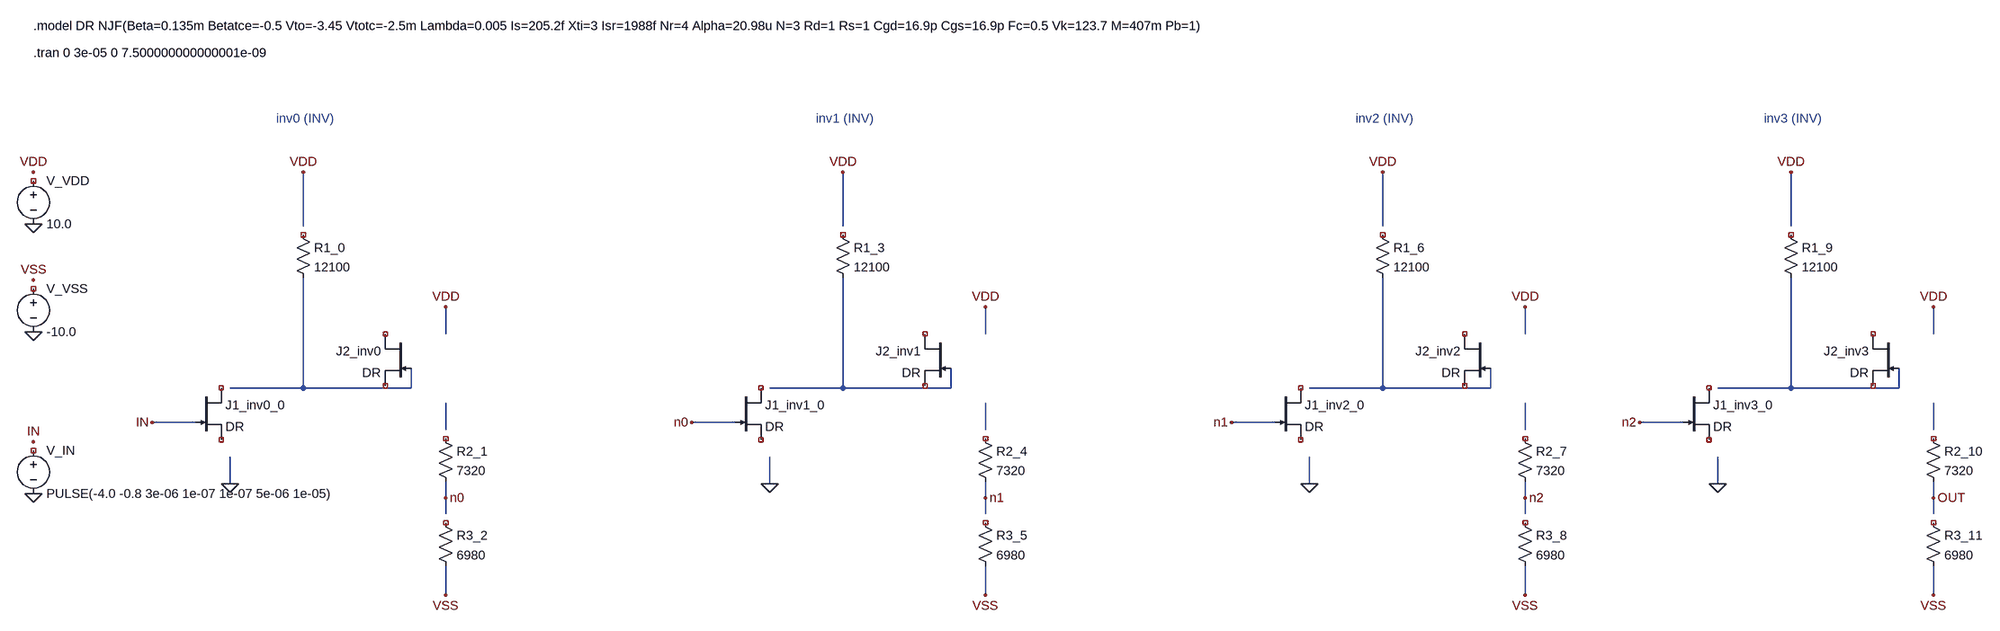
[diagram p0: schematic inv_chain_4.asc]
inv_chain_4.asc, the LTspice schematic file:
Version 4
SHEET 1 10000 10000
WIRE 0 0 0 100
FLAG 0 0 VDD
SYMBOL res -16 100 R0
SYMATTR InstName R1_0
SYMATTR Value 12100
WIRE 0 196 0 400
WIRE 0 400 -136 400
SYMBOL njf -200 400 R0
SYMATTR InstName J1_inv0_0
SYMATTR Value DR
WIRE -136 528 -136 578
FLAG -136 578 0
WIRE -200 464 -280 464
FLAG -280 464 IN
WIRE 0 400 200 400
WIRE 200 400 200 364
SYMBOL njf 200 300 M0
SYMATTR InstName J2_inv0
SYMATTR Value DR
WIRE 264 300 264 250
FLAG 264 250 VDD
WIRE 264 428 264 478
SYMBOL res 248 478 R0
SYMATTR InstName R2_1
SYMATTR Value 7320
WIRE 264 574 264 604
FLAG 264 604 n0
WIRE 264 604 264 634
SYMBOL res 248 634 R0
SYMATTR InstName R3_2
SYMATTR Value 6980
WIRE 264 730 264 784
FLAG 264 784 VSS
TEXT -50 -100 Left 2 ;inv0 (INV)
WIRE 1000 0 1000 100
FLAG 1000 0 VDD
SYMBOL res 984 100 R0
SYMATTR InstName R1_3
SYMATTR Value 12100
WIRE 1000 196 1000 400
WIRE 1000 400 864 400
SYMBOL njf 800 400 R0
SYMATTR InstName J1_inv1_0
SYMATTR Value DR
WIRE 864 528 864 578
FLAG 864 578 0
WIRE 800 464 720 464
FLAG 720 464 n0
WIRE 1000 400 1200 400
WIRE 1200 400 1200 364
SYMBOL njf 1200 300 M0
SYMATTR InstName J2_inv1
SYMATTR Value DR
WIRE 1264 300 1264 250
FLAG 1264 250 VDD
WIRE 1264 428 1264 478
SYMBOL res 1248 478 R0
SYMATTR InstName R2_4
SYMATTR Value 7320
WIRE 1264 574 1264 604
FLAG 1264 604 n1
WIRE 1264 604 1264 634
SYMBOL res 1248 634 R0
SYMATTR InstName R3_5
SYMATTR Value 6980
WIRE 1264 730 1264 784
FLAG 1264 784 VSS
TEXT 950 -100 Left 2 ;inv1 (INV)
WIRE 2000 0 2000 100
FLAG 2000 0 VDD
SYMBOL res 1984 100 R0
SYMATTR InstName R1_6
SYMATTR Value 12100
WIRE 2000 196 2000 400
WIRE 2000 400 1864 400
SYMBOL njf 1800 400 R0
SYMATTR InstName J1_inv2_0
SYMATTR Value DR
WIRE 1864 528 1864 578
FLAG 1864 578 0
WIRE 1800 464 1720 464
FLAG 1720 464 n1
WIRE 2000 400 2200 400
WIRE 2200 400 2200 364
SYMBOL njf 2200 300 M0
SYMATTR InstName J2_inv2
SYMATTR Value DR
WIRE 2264 300 2264 250
FLAG 2264 250 VDD
WIRE 2264 428 2264 478
SYMBOL res 2248 478 R0
SYMATTR InstName R2_7
SYMATTR Value 7320
WIRE 2264 574 2264 604
FLAG 2264 604 n2
WIRE 2264 604 2264 634
SYMBOL res 2248 634 R0
SYMATTR InstName R3_8
SYMATTR Value 6980
WIRE 2264 730 2264 784
FLAG 2264 784 VSS
TEXT 1950 -100 Left 2 ;inv2 (INV)
WIRE 3000 0 3000 100
FLAG 3000 0 VDD
SYMBOL res 2984 100 R0
SYMATTR InstName R1_9
SYMATTR Value 12100
WIRE 3000 196 3000 400
WIRE 3000 400 2864 400
SYMBOL njf 2800 400 R0
SYMATTR InstName J1_inv3_0
SYMATTR Value DR
WIRE 2864 528 2864 578
FLAG 2864 578 0
WIRE 2800 464 2720 464
FLAG 2720 464 n2
WIRE 3000 400 3200 400
WIRE 3200 400 3200 364
SYMBOL njf 3200 300 M0
SYMATTR InstName J2_inv3
SYMATTR Value DR
WIRE 3264 300 3264 250
FLAG 3264 250 VDD
WIRE 3264 428 3264 478
SYMBOL res 3248 478 R0
SYMATTR InstName R2_10
SYMATTR Value 7320
WIRE 3264 574 3264 604
FLAG 3264 604 OUT
WIRE 3264 604 3264 634
SYMBOL res 3248 634 R0
SYMATTR InstName R3_11
SYMATTR Value 6980
WIRE 3264 730 3264 784
FLAG 3264 784 VSS
TEXT 2950 -100 Left 2 ;inv3 (INV)
SYMBOL voltage -500 0 R0
SYMATTR InstName V_VDD
SYMATTR Value 10.0
FLAG -500 0 VDD
FLAG -500 96 0
SYMBOL voltage -500 200 R0
SYMATTR InstName V_VSS
SYMATTR Value -10.0
FLAG -500 200 VSS
FLAG -500 296 0
SYMBOL voltage -500 500 R0
SYMATTR InstName V_IN
SYMATTR Value PULSE(-4.0 -0.8 3e-06 1e-07 1e-07 5e-06 1e-05)
FLAG -500 500 IN
FLAG -500 596 0
TEXT -500 -300 Left 2 !.tran 0 3e-05 0 7.500000000000001e-09
TEXT -500 -350 Left 2 !.model DR NJF(Beta=0.135m Betatce=-0.5 Vto=-3.45 Vtotc=-2.5m Lambda=0.005 Is=205.2f Xti=3 Isr=1988f Nr=4 Alpha=20.98u N=3 Rd=1 Rs=1 Cgd=16.9p Cgs=16.9p Fc=0.5 Vk=123.7 M=407m Pb=1)

The netlist it stands for:
* inv_chain_4.asc
R1_0 NC_01 N001 12100
J1_inv0_0 NC_02 IN NC_03 DR
J2_inv0 NC_04 N001 NC_05 DR
R2_1 NC_06 n0 7320
R3_2 NC_07 VSS 6980
R1_3 NC_08 N003 12100
J1_inv1_0 NC_09 n0 NC_10 DR
J2_inv1 NC_11 N003 NC_12 DR
R2_4 NC_13 n1 7320
R3_5 NC_14 VSS 6980
R1_6 NC_15 N005 12100
J1_inv2_0 NC_16 n1 NC_17 DR
J2_inv2 NC_18 N005 NC_19 DR
R2_7 NC_20 n2 7320
R3_8 NC_21 VSS 6980
R1_9 NC_22 N007 12100
J1_inv3_0 NC_23 n2 NC_24 DR
J2_inv3 NC_25 N007 NC_26 DR
R2_10 NC_27 OUT 7320
R3_11 NC_28 VSS 6980
V_VDD NC_29 0 10.0
V_VSS NC_30 0 -10.0
V_IN NC_31 0 PULSE(-4.0 -0.8 3e-06 1e-07 1e-07 5e-06 1e-05)
.model NJF NJF
.model PJF PJF
.lib standard.jft
* inv0 (INV)
* inv1 (INV)
* inv2 (INV)
* inv3 (INV)
.tran 0 3e-05 0 7.500000000000001e-09
.model DR NJF(Beta=0.135m Betatce=-0.5 Vto=-3.45 Vtotc=-2.5m Lambda=0.005 Is=205.2f Xti=3 Isr=1988f Nr=4 Alpha=20.98u N=3 Rd=1 Rs=1 Cgd=16.9p Cgs=16.9p Fc=0.5 Vk=123.7 M=407m Pb=1)
.backanno
.end